# EAGLE design NES PSU Replacement (EAGLE 9.6.2)
PROJ_NAME: NES Power Supply Replacement; PROJ_REV: B

## Sheet 1 of 2: Switching Power Supply
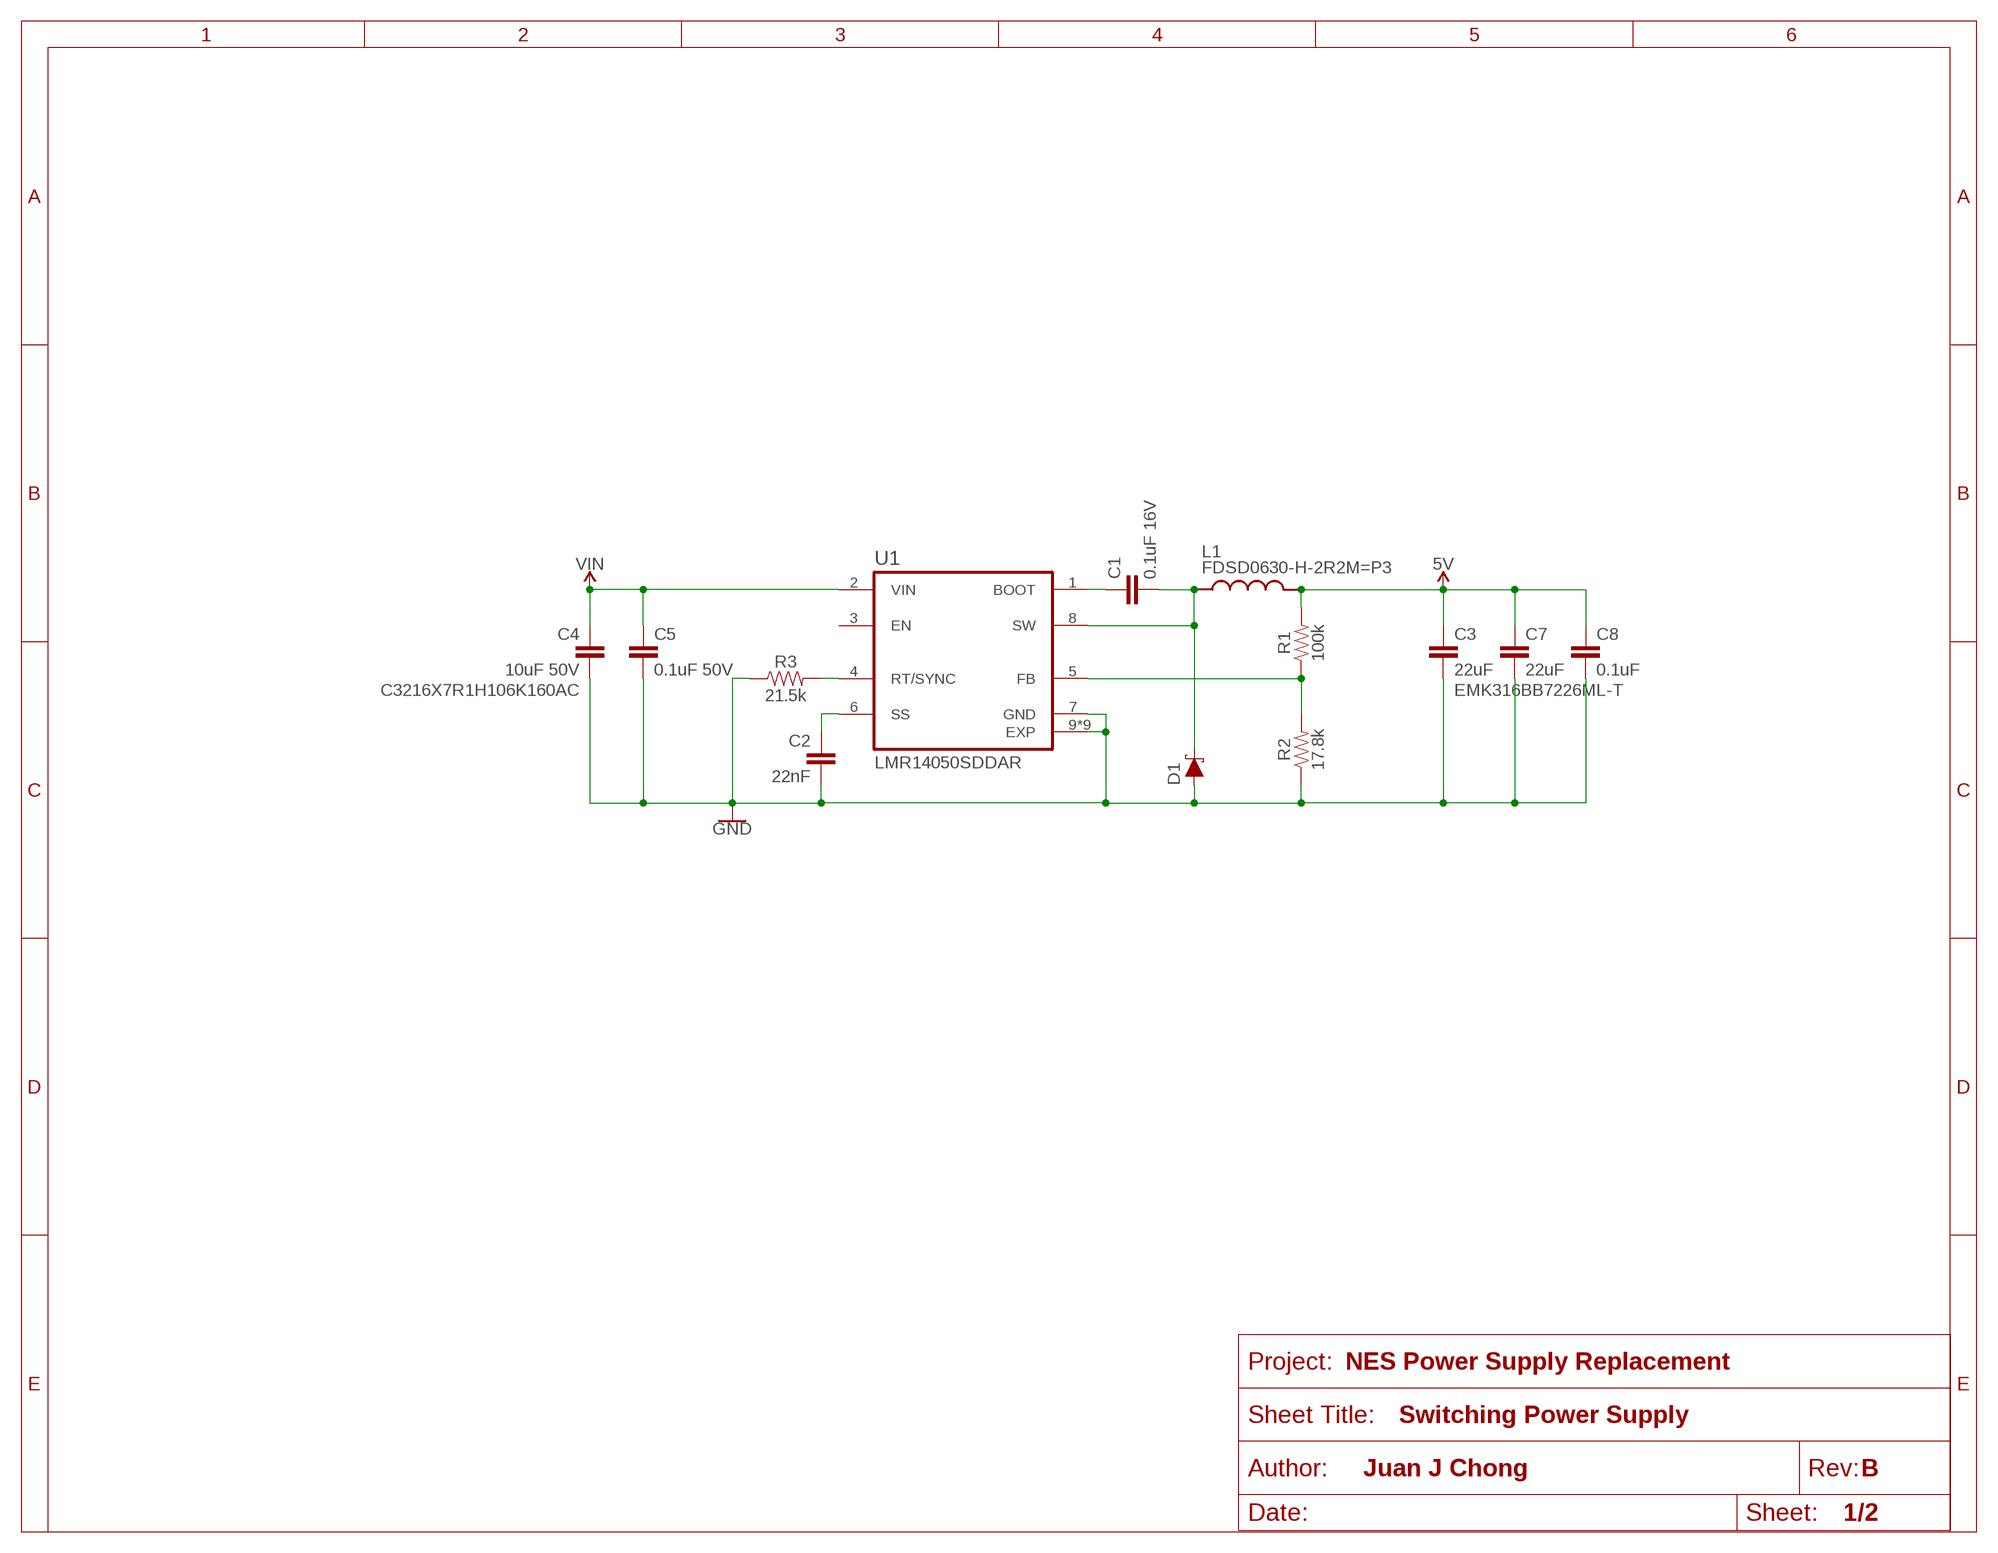
[diagram p0: schematic, sheet 1]

### Parts
C1  0.1uF 16V  CAP-0603  [0603]
C2  22nF  CAP-0603  [0603]
C3  22uF  CAP-1206  [1206]
C4  10uF 50V  CAP-1206  [1206]
C5  0.1uF 50V  CAP-0603  [0603]
C7  22uF  CAP-1206  [1206]
C8  0.1uF  CAP-0603  [0603]
D1  1A/15V/220mV  DIODE-SCHOTTKY-SK86C  [DO-214AB]
L1  FDSD0630-H-2R2M=P3  [IND_FDSD0630-H-2R2M=P3]
R1  100k  RESISTOR0603  [0603]
R2  17.8k  RESISTOR0603  [0603]
R3  21.5k  RESISTOR0603  [0603]
U1  LMR14050SDDAR  [VREG_LM5017MR/NOPB]

### Nets
5V: C3.1 C7.1 C8.1 L1.2 R1.2 ; also sheet 2
GND: C2.2 C3.2 C4.2 C5.2 C7.2 C8.2 D1.2(A) R2.1 R3.1 U1.7(GND) U1.9(EXP) U1.10(EXP) U1.11(EXP) U1.12(EXP) U1.13(EXP) U1.14(EXP) U1.15(EXP) U1.16(EXP) U1.17(EXP) ; also sheet 2
N$1: R1.1 R2.2 U1.5(FB)
N$2: R3.2 U1.4(RT/SYNC)
N$3: C2.1 U1.6(SS)
N$4: C1.2 D1.1(C) L1.1 U1.8(SW)
N$5: C1.1 U1.1(BOOT)
VIN: C4.1 C5.1 U1.2(VIN) ; also sheet 2
Unconnected: U1.3(EN)

### Notes on the sheet
- C3216X7R1H106K160AC | EMK316BB7226ML-T

## Sheet 2 of 2: Video Interface
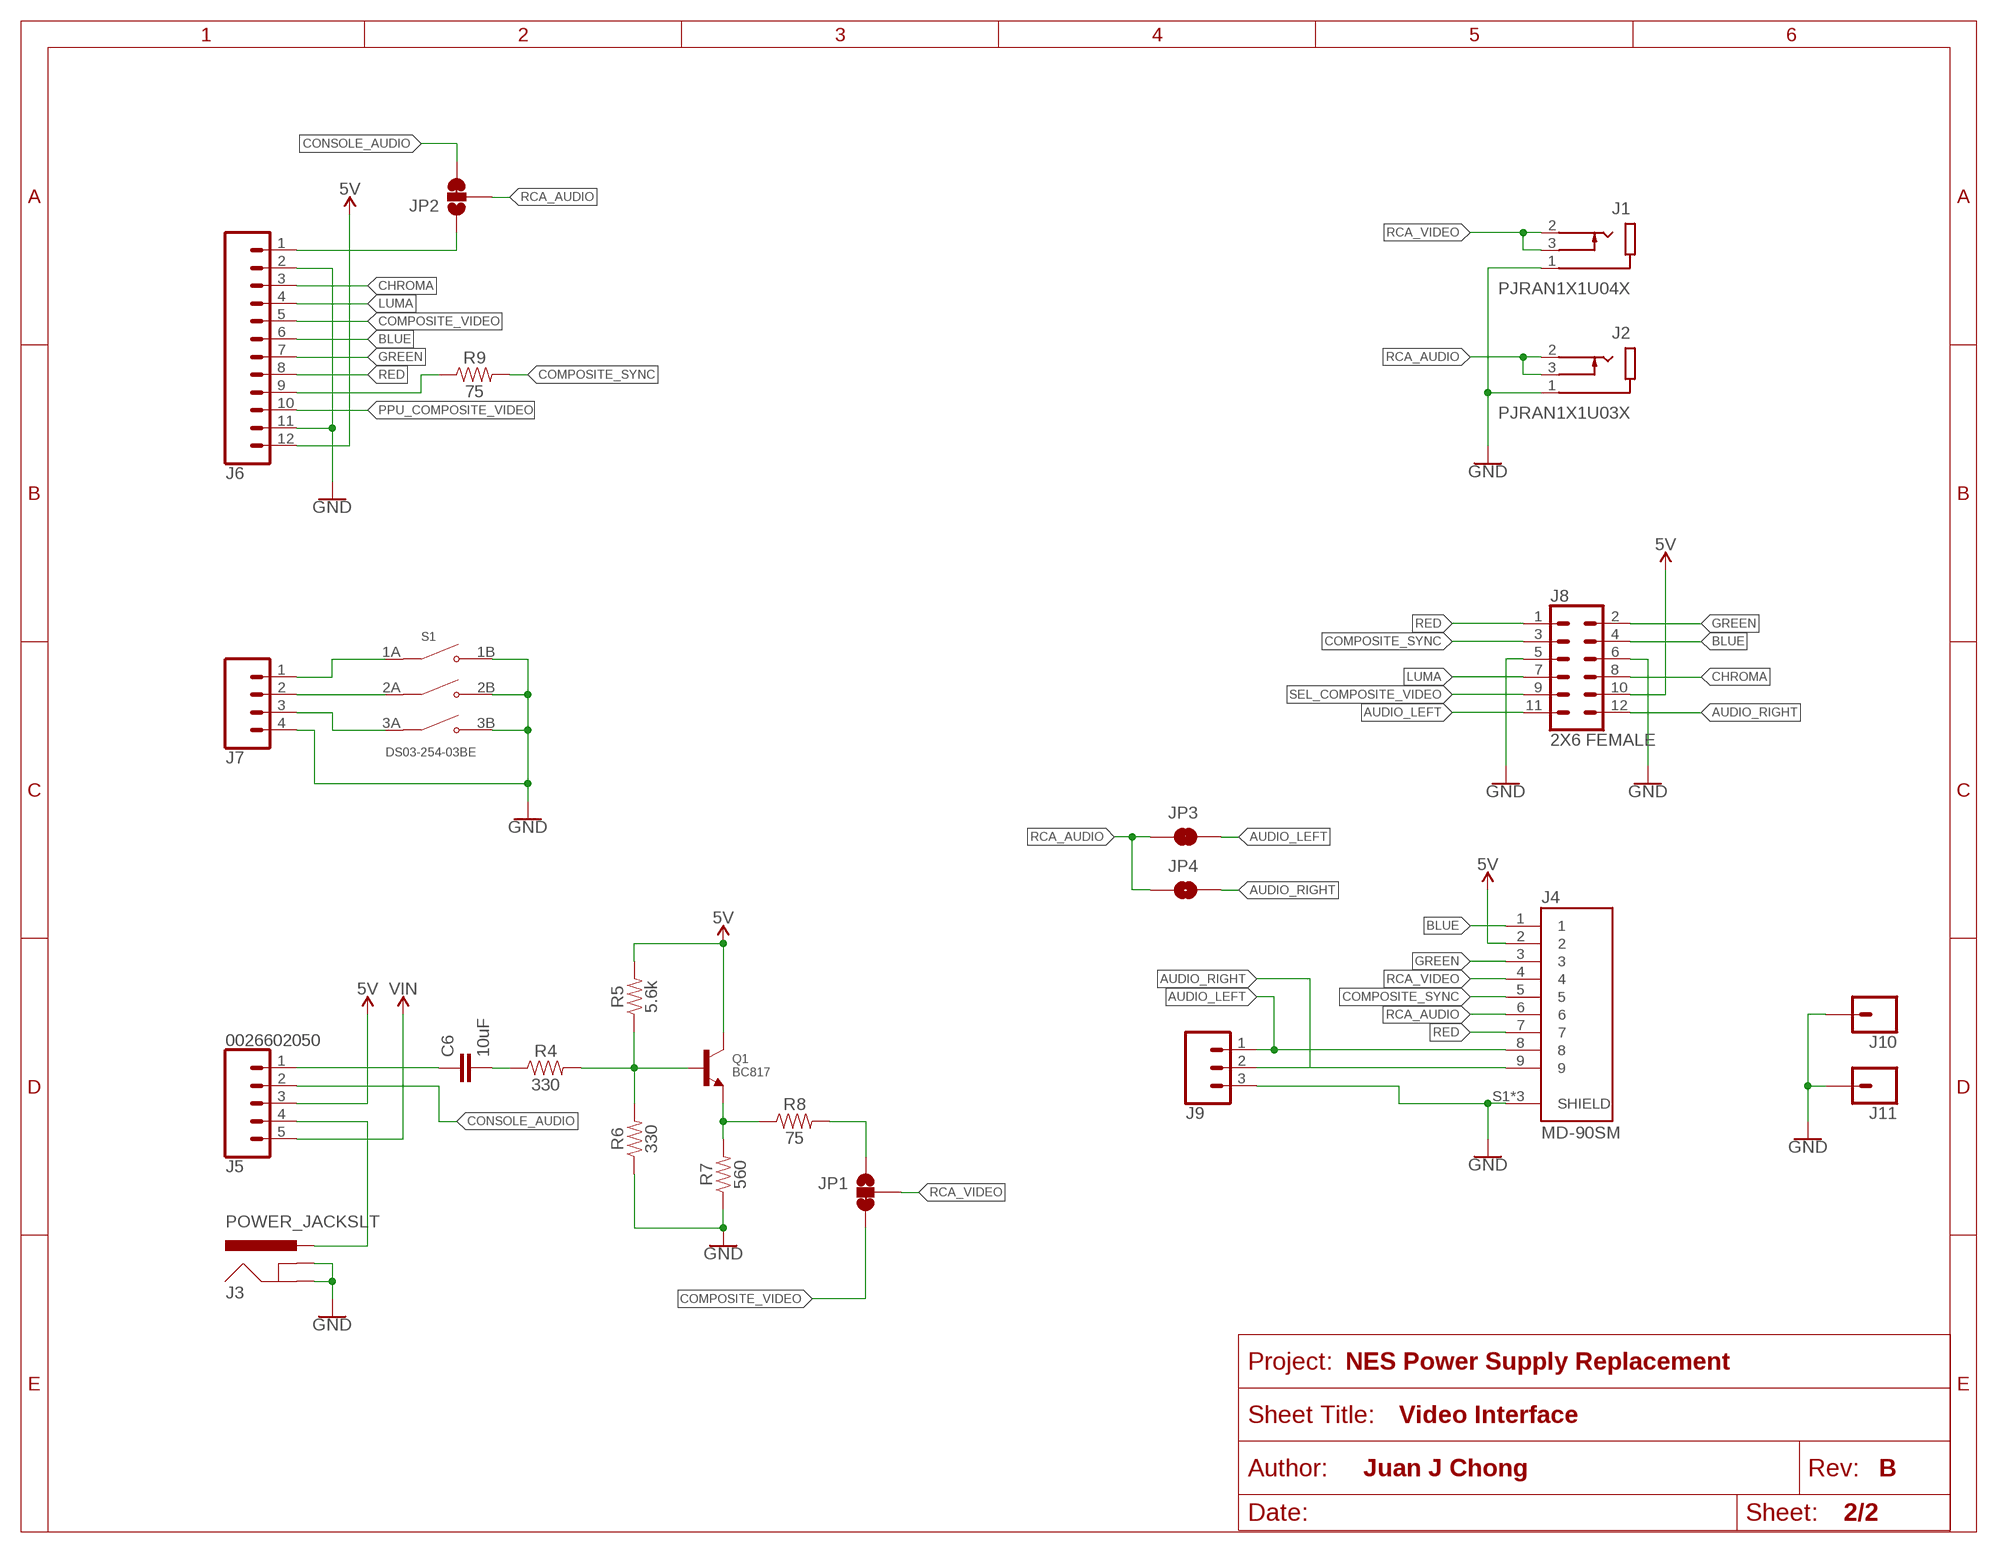
[diagram p1: schematic, sheet 2]

### Parts
C6  10uF  CAP-1206  [1206]
J1  PJRAN1X1U04X  PJRAN1X1U02AUX  [SWITCHCRAFT_PJRAN1X1U02AUX]
J2  PJRAN1X1U03X  PJRAN1X1U02AUX  [SWITCHCRAFT_PJRAN1X1U02AUX]
J3  POWER_JACKSLT  [POWER_JACK_SLOT]
J4  MD-90SM  [CUI_MD-90SM]
J5  0026602050  CONN_053.96MM  [1X05_3.96MM]
J6  CONN_12LONGPADS  [1X12_LONGPADS]
J7  CONN_04LONGPADS  [1X04_LONGPADS]
J8  2X6 FEMALE  CONN_06X2PTH_FEMALE  [2X6]
J9  CONN_03LONGPADS  [1X03_LONGPADS]
J10  CONN_01KEYSTONE_1216  [1X01_1216]
J11  CONN_01KEYSTONE_1216  [1X01_1216]
JP1  JUMPER-SMT_3_1-NC_TRACE_SILK  [SMT-JUMPER_3_1-NC_TRACE_SILK]
JP2  JUMPER-SMT_3_1-NC_TRACE_SILK  [SMT-JUMPER_3_1-NC_TRACE_SILK]
JP3  JUMPER-SMT_2_NC_TRACE_SILK  [SMT-JUMPER_2_NC_TRACE_SILK]
JP4  JUMPER-SMT_2_NO_SILK  [SMT-JUMPER_2_NO_SILK]
Q1  BC817  TRANSISTOR_NPN  [SOT23-R]
R4  330  RESISTOR0603  [0603]
R5  5.6k  RESISTOR0603  [0603]
R6  330  RESISTOR0603  [0603]
R7  560  RESISTOR0603  [0603]
R8  75  RESISTOR0603  [0603]
R9  75  RESISTOR0603  [0603]
S1  DS03-254-03BE  [SW_DS03-254-03BE]

### Nets
5V: J4.2 J5.3 J6.12 J8.10 Q1.3(C) R5.2 ; also sheet 1
AUDIO_LEFT: J4.8 J8.11 J9.1 JP3.2
AUDIO_RIGHT: J4.9 J8.12 J9.2 JP4.2
BLUE: J4.1 J6.6 J8.4
CHROMA: J6.3 J8.8
COMPOSITE_SYNC: J4.5 J8.3 R9.2
COMPOSITE_VIDEO: J6.5 JP1.3
CONSOLE_AUDIO: J5.2 JP2.3
GND: J1.1(SLEEVE) J2.1(SLEEVE) J3.GND@1(GNDBREAK) J3.GND@2(GND) J4.S1(SHIELD) J4.S2(SHIELD) J4.S3(SHIELD) J6.2 J6.11 J7.4 J8.5 J8.6 J9.3 J10.P$1 J10.P$2 J11.P$1 J11.P$2 R6.1 R7.1 S1.1B(NO1) S1.2B(NO2) S1.3B(NO3) ; also sheet 1
GREEN: J4.3 J6.7 J8.2
LUMA: J6.4 J8.7
N$6: J7.1 S1.1A(COM1)
N$7: J7.2 S1.2A(COM2)
N$8: J7.3 S1.3A(COM3)
N$9: Q1.1(B) R4.2 R5.1 R6.2
N$10: J3.PWR J5.4
N$11: JP1.1 R8.2
N$12: C6.2 R4.1
N$13: Q1.2(E) R7.2 R8.1
N$15: C6.1 J5.1
N$16: J6.9 R9.1
N$17: J6.1 JP2.1
PPU_COMPOSITE_VIDEO: J6.10
RCA_AUDIO: J2.2(TIP) J2.3(SHUNT) J4.6 JP2.2 JP3.1 JP4.1
RCA_VIDEO: J1.2(TIP) J1.3(SHUNT) J4.4 JP1.2
RED: J4.7 J6.8 J8.1
SEL_COMPOSITE_VIDEO: J8.9
VIN: J5.5 ; also sheet 1

## Library data of the parts
C1-C8 = SparkFun-Capacitors:CAP
D1 = SparkFun-DiscreteSemi:DIODE-SCHOTTKY: Schottky diode A Schottky diode is a semiconductor diode which has a low forward voltage drop and a very fast switching action.
J1 J2 = PJRAN1X1U02AUX:PJRAN1X1U02AUX: 3.20mm ID, 9.00mm OD (RCA) Phono (RCA) Jack Mono Connector Solder Check prices <https://pricing.snapeda.com/parts/PJRAN1X1U02AUX/Switchcraft/view-part?ref=eda>; AVAILABILITY: Good; DESCRIPTION: RCA Phono Connectors RCA PHONO JACK WHT.; MF: Switchcraft; MP: PJRAN1X1U02AUX; PACKAGE: None; PRICE: None; PURCHASE-URL: https://pricing.snapeda.com/search/part/PJRAN1X1U02AUX/?ref=eda
J3 = SparkFun-Connectors:POWER_JACK: Power Jack Connector This is the standard 5.5mm barrel jack for power. The PTH is the most common, proven, reliable, footprint. The Slot footprint only works if the mill layer is transmitted to the PCB fab house so be warned. Here are the connectors we sell at SparkFun: DC Barrel Power Jack/Connector <https://www.sparkfun.com/products/119> (PRT-00119) DC Barrel Power Jack/Connector (SMD) <https://www.sparkfun.com/products/12748> (PRT-12748) DC Barrel Jack Adapter - Breadboard Compatible <https://www.sparkfun.com/products/10811> (PRT-10811) It is used on this SparkFun product (and many, many others): SparkFun RedBoard - Programmed with Arduino <https://www.sparkfun.com/products/12757> (DEV-12757) Also, if you need a mating power supply or connector, please check these out: Wall Adapter Power Supply - 9VDC 650mA <https://www.sparkfun.com/products/298> (TOL-00298) DC Barrel Jack Adapter - Male <https://www.sparkfun.com/products/10287> (PRT-10287); PROD_ID: PRT-00119
J4 = MD-90SM:MD-90SM: 3~9 Positions, Receptacle, Right Angle, Through Hole, Shielded, Mini Circular DIN Connector Check prices <https://pricing.snapeda.com/parts/MD-90SM/CUI%20Devices/view-part?ref=eda>; AVAILABILITY: Good; CUI_PURCHASE_URL: https://www.cuidevices.com/product/interconnect/connectors/din-connectors/md-sm-series?utm_source=snapeda.com&utm_medium=referral&utm_campaign=snapedaBOM; DESCRIPTION: 3~9 Positions, Receptacle, Right Angle, Through Hole, Shielded, Mini Circular DIN Connector; MF: CUI Devices; MP: MD-90SM; PACKAGE: None; PRICE: None; PURCHASE-URL: https://pricing.snapeda.com/search/part/MD-90SM/?ref=eda
J5 = SparkFun-Connectors:CONN_05: Multi connection point. Often used as Generic Header-pin footprint for 0.1 inch spaced/style header connections On any of the 0.1 inch spaced packages, you can populate with these: Break Away Headers - Straight <https://www.sparkfun.com/products/116> (PRT-00116) Break Away Male Headers - Right Angle <https://www.sparkfun.com/products/553> (PRT-00553) Female Headers <https://www.sparkfun.com/products/115> (PRT-00115) Break Away Headers - Machine Pin <https://www.sparkfun.com/products/117> (PRT-00117) Break Away Female Headers - Swiss Machine Pin <https://www.sparkfun.com/products/743> (PRT-00743) For SCREWTERMINALS and SPRING TERMINALS visit here: Screw Terimnals on SparkFun.com <https://www.sparkfun.com/search/results?term=Screw+Terminals> (5mm/3.5mm/2.54mm spacing) This device is also useful as a general connection point to wire up your design to another part of your project. Our various solder wires solder well into these plated through hole pads. Hook-Up Wire - Assortment (Stranded, 22 AWG) <https://www.sparkfun.com/products/11375> (PRT-11375) Hook-Up Wire - Assortment (Solid Core, 22 AWG) <https://www.sparkfun.com/products/11367> (PRT-11367) View the entire wire category on our website here <https://www.sparkfun.com/categories/141> Special notes: Molex polarized connector foot print use with SKU : PRT-08231 with associated crimp pins and housings. 1MM SMD Version SKU: PRT-10208
J6 = SparkFun-Connectors:CONN_12: Multi connection point. Often used as Generic Header-pin footprint for 0.1 inch spaced/style header connections On any of the 0.1 inch spaced packages, you can populate with these: Break Away Headers - Straight <https://www.sparkfun.com/products/116> (PRT-00116) Break Away Male Headers - Right Angle <https://www.sparkfun.com/products/553> (PRT-00553) Female Headers <https://www.sparkfun.com/products/115> (PRT-00115) Break Away Headers - Machine Pin <https://www.sparkfun.com/products/117> (PRT-00117) Break Away Female Headers - Swiss Machine Pin <https://www.sparkfun.com/products/743> (PRT-00743) For SCREWTERMINALS and SPRING TERMINALS visit here: Screw Terimnals on SparkFun.com <https://www.sparkfun.com/search/results?term=Screw+Terminals> (5mm/3.5mm/2.54mm spacing) This device is also useful as a general connection point to wire up your design to another part of your project. Our various solder wires solder well into these plated through hole pads. Hook-Up Wire - Assortment (Stranded, 22 AWG) <https://www.sparkfun.com/products/11375> (PRT-11375) Hook-Up Wire - Assortment (Solid Core, 22 AWG) <https://www.sparkfun.com/products/11367> (PRT-11367) View the entire wire category on our website here <https://www.sparkfun.com/categories/141> Special notes: Molex polarized connector foot print use with SKU : PRT-08231 with associated crimp pins and housings. 1MM SMD Version SKU: PRT-10208 NOTES ON THE VARIANTS LOCK and LOCK_LONGPADS... This footprint was designed to help hold the alignment of a through-hole component (i.e. 6-pin header) while soldering it into place. You may notice that each hole has been shifted either up or down by 0.005 of an inch from it's more standard position (which is a perfectly straight line). This slight alteration caused the pins (the squares in the middle) to touch the edges of the holes. Because they are alternating, it causes a "brace" to hold the component in place. 0.005 has proven to be the perfect amount of "off-center" position when using our standard breakaway headers. Although looks a little odd when you look at the bare footprint, once you have a header in there, the alteration is very hard to notice. Also,if you push a header all the way into place, it is covered up entirely on the bottom side.
J7 = SparkFun-Connectors:CONN_04: Multi connection point. Often used as Generic Header-pin footprint for 0.1 inch spaced/style header connections On any of the 0.1 inch spaced packages, you can populate with these: Break Away Headers - Straight <https://www.sparkfun.com/products/116> (PRT-00116) Break Away Male Headers - Right Angle <https://www.sparkfun.com/products/553> (PRT-00553) Female Headers <https://www.sparkfun.com/products/115> (PRT-00115) Break Away Headers - Machine Pin <https://www.sparkfun.com/products/117> (PRT-00117) Break Away Female Headers - Swiss Machine Pin <https://www.sparkfun.com/products/743> (PRT-00743) For SCREWTERMINALS and SPRING TERMINALS visit here: Screw Terimnals on SparkFun.com <https://www.sparkfun.com/search/results?term=Screw+Terminals> (5mm/3.5mm/2.54mm spacing) This device is also useful as a general connection point to wire up your design to another part of your project. Our various solder wires solder well into these plated through hole pads. Hook-Up Wire - Assortment (Stranded, 22 AWG) <https://www.sparkfun.com/products/11375> (PRT-11375) Hook-Up Wire - Assortment (Solid Core, 22 AWG) <https://www.sparkfun.com/products/11367> (PRT-11367) View the entire wire category on our website here <https://www.sparkfun.com/categories/141> Special notes: Molex polarized connector foot print use with SKU : PRT-08231 with associated crimp pins and housings. 1MM SMD Version SKU: PRT-10208; PROD_ID: CONN-09696
J8 = SparkFun-Connectors:CONN_06X2: Multi connection point. Often used as Generic Header-pin footprint for 0.1 inch spaced/style header connections On any of the 0.1 inch spaced packages, you can populate with these: Break Away Headers - Straight <https://www.sparkfun.com/products/116> (PRT-00116) Break Away Male Headers - Right Angle <https://www.sparkfun.com/products/553> (PRT-00553) Female Headers <https://www.sparkfun.com/products/115> (PRT-00115) Break Away Headers - Machine Pin <https://www.sparkfun.com/products/117> (PRT-00117) Break Away Female Headers - Swiss Machine Pin <https://www.sparkfun.com/products/743> (PRT-00743); PROD_ID: CONN-12423
J9 = SparkFun-Connectors:CONN_03: Multi connection point. Often used as Generic Header-pin footprint for 0.1 inch spaced/style header connections On any of the 0.1 inch spaced packages, you can populate with these: Break Away Headers - Straight <https://www.sparkfun.com/products/116> (PRT-00116) Break Away Male Headers - Right Angle <https://www.sparkfun.com/products/553> (PRT-00553) Female Headers <https://www.sparkfun.com/products/115> (PRT-00115) Break Away Headers - Machine Pin <https://www.sparkfun.com/products/117> (PRT-00117) Break Away Female Headers - Swiss Machine Pin <https://www.sparkfun.com/products/743> (PRT-00743) Stackable Header - 3 Pin (Female, 0.1") <https://www.sparkfun.com/products/13875> (PRT-13875) For SCREWTERMINALS and SPRING TERMINALS visit here: Screw Terimnals on SparkFun.com <https://www.sparkfun.com/search/results?term=Screw+Terminals> (5mm/3.5mm/2.54mm spacing) This device is also useful as a general connection point to wire up your design to another part of your project. Our various solder wires solder well into these plated through hole pads. Hook-Up Wire - Assortment (Stranded, 22 AWG) <https://www.sparkfun.com/products/11375> (PRT-11375) Hook-Up Wire - Assortment (Solid Core, 22 AWG) <https://www.sparkfun.com/products/11367> (PRT-11367) View the entire wire category on our website here <https://www.sparkfun.com/categories/141> Special notes: Molex polarized connector foot print use with SKU : PRT-08232 with associated crimp pins and housings.
J10 J11 = SparkFun-Connectors:CONN_01: Single connection point. Often used as Generic Header-pin footprint for 0.1 inch spaced/style header connections On any of the 0.1 inch spaced packages, you can populate with these: Break Away Headers - Straight <https://www.sparkfun.com/products/116> (PRT-00116) Break Away Male Headers - Right Angle <https://www.sparkfun.com/products/553> (PRT-00553) Female Headers <https://www.sparkfun.com/products/115> (PRT-00115) Break Away Headers - Machine Pin <https://www.sparkfun.com/products/117> (PRT-00117) Break Away Female Headers - Swiss Machine Pin <https://www.sparkfun.com/products/743> (PRT-00743) This device is also useful as a general connection point to wire up your design to another part of your project. Our various solder wires solder well into these plated through hole pads. Hook-Up Wire - Assortment (Stranded, 22 AWG) <https://www.sparkfun.com/products/11375> (PRT-11375) Hook-Up Wire - Assortment (Solid Core, 22 AWG) <https://www.sparkfun.com/products/11367> (PRT-11367) View the entire wire category on our website here <https://www.sparkfun.com/categories/141> Special notes: SMTSO-256-ET is a "flush mount" nut for a 4-40 screw. We mostly use this on specialty testbeds; it is a nice way to connect hardware to your PCB at an adjustable hieght. Also note, the SNAP packages are for using a snappable style connector. We sell a baggie of snaps and they are also used on two LilyPad designs: Snap Assortment - 30 pack (male and female) <https://www.sparkfun.com/products/11347> (DEV-11347) LilyPad Arduino SimpleSnap <https://www.sparkfun.com/products/10941> (DEV-10941) LilyPad SimpleSnap Protoboard <https://www.sparkfun.com/products/10940> (DEV-10940)
JP1 JP2 = SparkFun-Jumpers:JUMPER-SMT_3_1-NC_TRACE: Normally closed trace jumper (1 of 2 connections) This jumper has a trace between two pads so it's normally closed (NC). The other connection is normally open (NO). Use a razor knife to open the connection. For best results follow the IPC guidelines for cutting traces: Cutout at least 0.063 mm (0.005 in). Remove all loose material to clean up the cut area. Seal the cut with an approved epoxy. Reapply solder to reclose the connection, or to close the NO connection.
JP3 = SparkFun-Jumpers:JUMPER-SMT_2_NC_TRACE: Normally closed trace jumper This jumper has a trace between two pads so it's normally closed (NC). Use a razor knife to open the connection. For best results follow the IPC guidelines for cutting traces: Cutout at least 0.063 mm (0.005 in). Remove all loose material to clean up the cut area. Seal the cut with an approved epoxy. Reapply solder to reclose the connection.
JP4 = SparkFun-Jumpers:JUMPER-SMT_2_NO: Normally open jumper This jumper has two pads in close proximity to each other. Apply solder to close the connection. Round pads are easier to solder for beginners, but are a lot larger. SparkFun Product that uses the round pads: SparkFun EL Sequencer <https://www.sparkfun.com/products/12781>
L1 = FDSD0630-H-2R2M_P3:FDSD0630-H-2R2M=P3: 2.2µH Shielded Wirewound Inductor 7.1A 17mOhm Max Nonstandard Check prices <https://pricing.snapeda.com/parts/FDSD0630-H-2R2M%3DP3/Murata/view-part?ref=eda>; AVAILABILITY: Warning; DESCRIPTION: Inductor with Inductance: 2.2uH Tol. +/-20%, Package: 2726 (7066); MF: Murata; MP: FDSD0630-H-2R2M=P3; PACKAGE: NONSTANDARD; PRICE: None; PURCHASE-URL: https://pricing.snapeda.com/search/part/FDSD0630-H-2R2M=P3/?ref=eda
Q1 = microbuilder:TRANSISTOR_NPN: NPN Transistor Transistor (NPN) 500mA 45V - BC817 [Digikey: 568-1631-1-ND] Transistor (NPN) 500mA 45V - BC817,215 [Mouser: 771-BC817-T/R] SOT23-R - SOT23 footprint optimised for use with solder paste and reflow ovens. SOT23-W - SOT23 footprint optimised for hand-soldering (larger pads).
R1-R9 = SparkFun-Resistors:RESISTOR: Generic Resistor Package
S1 = DS03-254-03BE:DS03-254-03BE: Check prices <https://pricing.snapeda.com/parts/DS03-254-03BE/CUI%20Devices/view-part?ref=eda>; AVAILABILITY: Warning; CUI_PURCHASE_URL: https://www.cuidevices.com/product/switches/dip-switches/ds03-254-series?utm_source=snapeda.com&utm_medium=referral&utm_campaign=snapedaBOM; DESCRIPTION: 3 Position, Through Hole, 2.54 mm, Flat Slide Actuator, Convex Bottom, Long Pin, DIP Switch; MF: CUI Devices; MP: DS03-254-03BE; PACKAGE: None; PRICE: None; PURCHASE-URL: https://pricing.snapeda.com/search/part/DS03-254-03BE/?ref=eda
U1 = LMR14050SDDAR:LMR14050SDDAR: Check prices <https://pricing.snapeda.com/parts/LMR14050SDDAR/Texas%20Instruments/view-part?ref=eda> Check prices <https://pricing.snapeda.com/parts/LMR14050SDDAR/Texas%20Instruments/view-part?ref=eda> Check prices <https://pricing.snapeda.com/parts/LMR14050SDDAR/Texas%20Instruments/view-part?ref=eda>; AVAILABILITY: Warning; DESCRIPTION: SIMPLE SWITCHER 40-V, 5-A, 2.2-MHz step-down converter with 40-?A IQ 8-SO PowerPAD -40 to 125; MF: Texas Instruments; MP: LMR14050SDDAR; PACKAGE: HSOIC-8 Texas Instruments; PRICE: None; PURCHASE-URL: https://pricing.snapeda.com/search/part/LMR14050SDDAR/?ref=eda

## Board
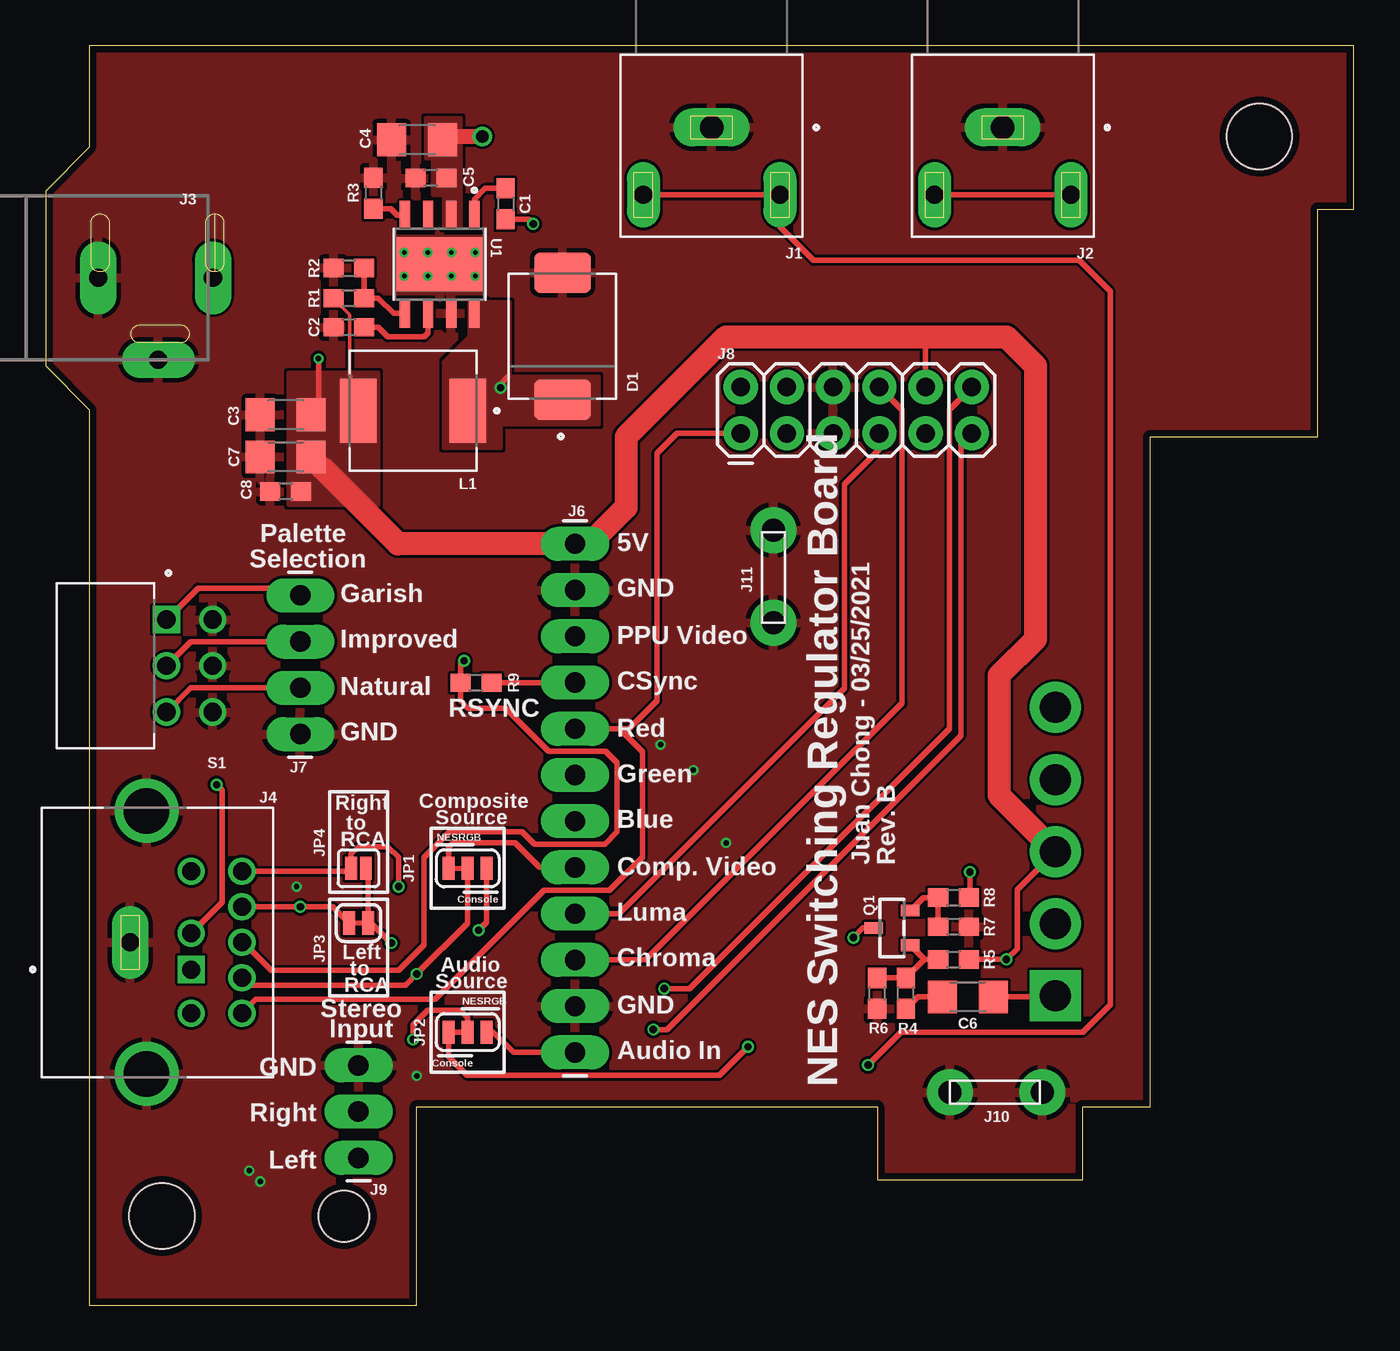
[diagram p2: board, top side]
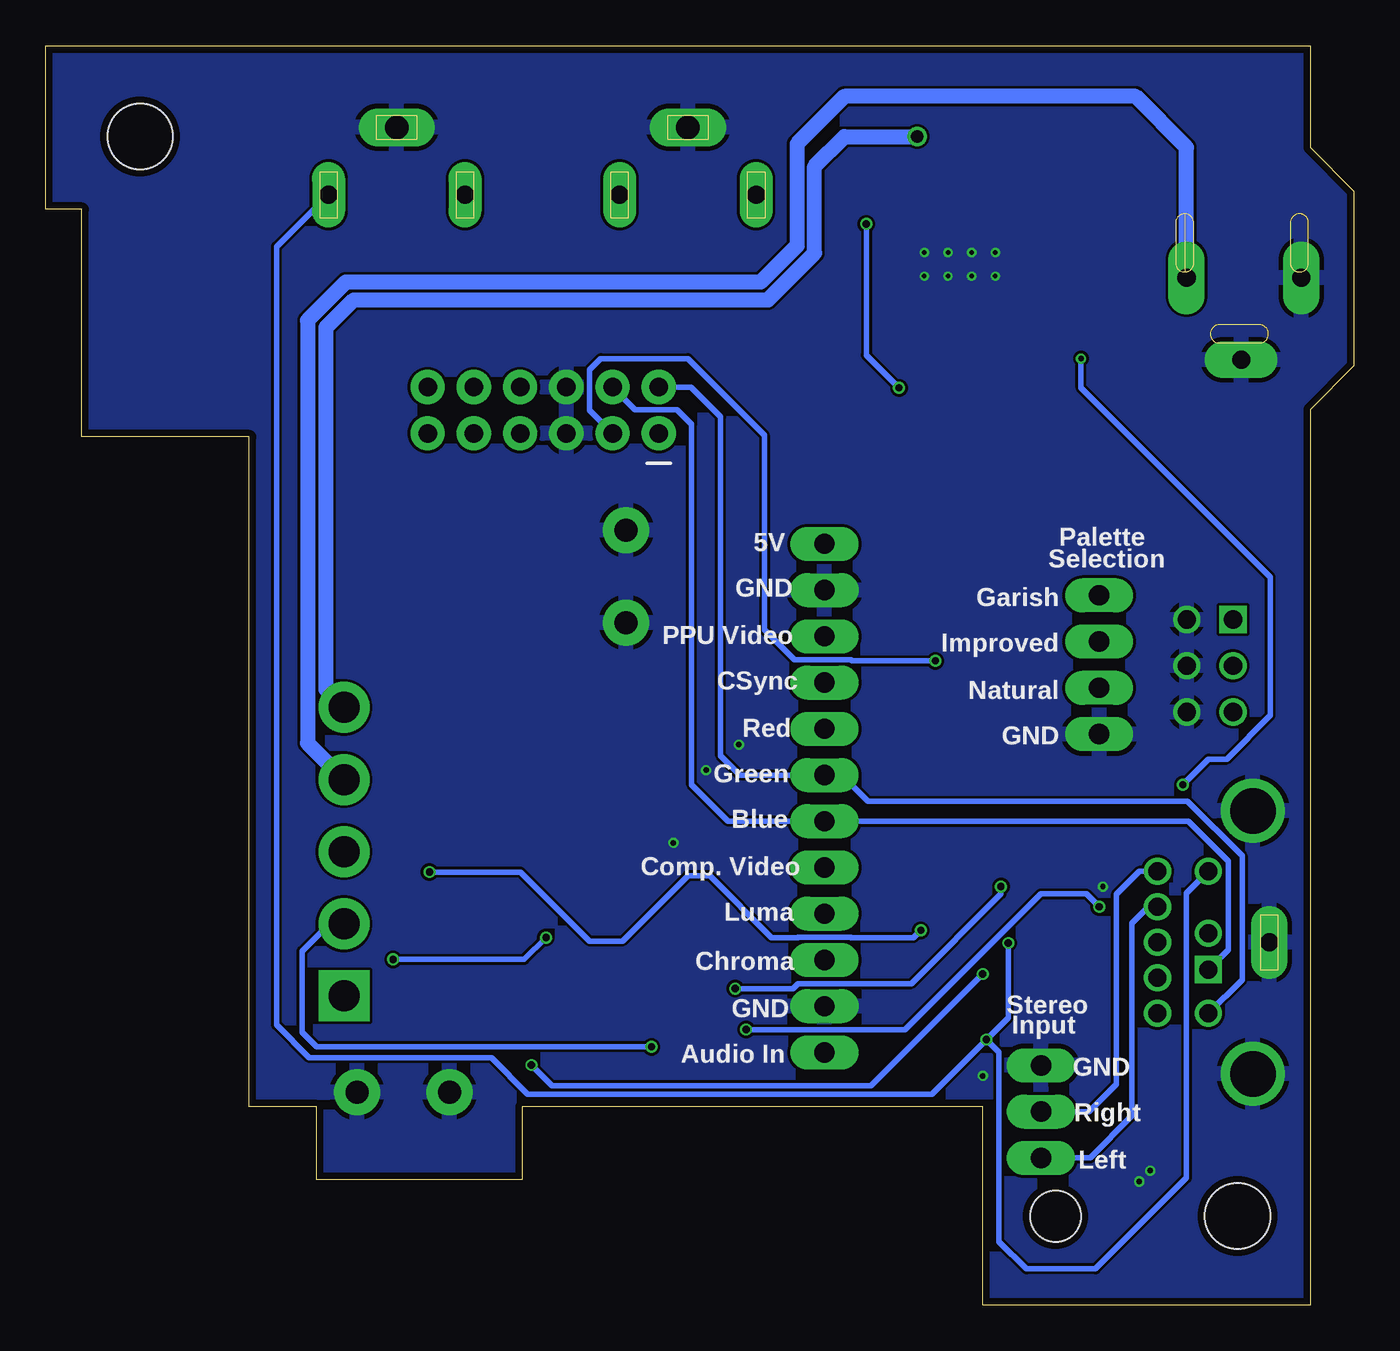
[diagram p3: board, bottom side, seen from below]

Size 71.9 x 69.2 mm. Coordinates in mm from the lower left corner, seen from the top.
Outline: 20.4,10.9 45.7,10.9 45.7,6.9 57,6.9 57,10.9 60.7,10.9 60.7,47.7 69.9,47.7 69.9,60.2 71.9,60.2 71.9,69.2 2.4,69.2 2.4,63.6 0,61.2 0,51.6 2.4,49.2 2.4,0 20.4,0 20.4,10.9
Copper layers (1*16): Top 0.035559375mm / dielectric 1.6mm / Bottom 0.035559375mm
Design rules "oshpark-2layer-covered-vias": minimum track width 6mil, minimum drill 10mil, track to track 6mil, track to pad 6mil, pad to pad 6mil, via to via 6mil, smd to smd 6mil, copper to edge 15mil, drill to drill 6mil, minimum pad ring 5mil, minimum via ring 5mil, stop-mask expansion 2.5mil, vias tented up to drill 0mil, thermal gap 10mil
Holes 3.6 mm at 66.7,64.2 6.4,4.9
Holes 2.8 mm at 16.4,4.9

### Footprints (pad centres in the part's own frame; a part is rotated, then mirrored left to right if it is on the bottom)
0603 = smd 1.1 x 1: 1 -0.85,0; 2 0.85,0
1206 = smd 1.6 x 1.8: 1 -1.4,0; 2 1.4,0
DO-214AB = smd 2.18 x 3.12: 1 -3.485,0; 2 3.485,0
SWITCHCRAFT_PJRAN1X1U02AUX = drill 1.3 pad 2.1 long: 1 0,0 | drill 1 pad 1.8 long: 2 -3.75,3.7; 3 3.75,3.7
POWER_JACK_SLOT = drill 1 pad 2 long: GND@1 4.5,7.4; GND@2 9,10.7; PWR 4.5,13.7
CUI_MD-90SM = drill 1 square: 1 1.5,1.85 | drill 1: 2 -0.5,1.85; 3 3.9,1.85; 4 1.95,4.65; 5 0,4.65; 6 -3.9,1.85; 7 3.9,4.65; 8 -1.95,4.65; 9 -3.9,4.65 | drill 2.5: S1 7.225,-0.6; S2 -7.225,-0.6 | drill 1 pad 2 long: S3 0,-1.5
1X05_3.96MM = drill 1.7 pad 2.8 square: 1 0,0 | drill 1.7 pad 2.8: 2 3.96,0; 3 7.92,0; 4 11.88,0; 5 15.84,0
1X12_LONGPADS = drill 1.118 pad 1.88 long: 1 0,0; 2 2.54,0; 3 5.08,0; 4 7.62,0; 5 10.16,0; 6 12.7,0; 7 15.24,0; 8 17.78,0; 9 20.32,0; 10 22.86,0; 11 25.4,0; 12 27.94,0
1X04_LONGPADS = drill 1.118 pad 1.88 long: 1 0,0; 2 2.54,0; 3 5.08,0; 4 7.62,0
2X6 = drill 1.016 pad 1.88: 1 0,0; 2 0,2.54; 3 2.54,0; 4 2.54,2.54; 5 5.08,0; 6 5.08,2.54; 7 7.62,0; 8 7.62,2.54; 9 10.16,0; 10 10.16,2.54; 11 12.7,0; 12 12.7,2.54
1X03_LONGPADS = drill 1.118 pad 1.88 long: 1 0,0; 2 2.54,0; 3 5.08,0
1X01_1216 = drill 1.27 pad 2.54: P$1 0,0; P$2 5.08,0
SMT-JUMPER_3_1-NC_TRACE_SILK = smd 0.66 x 1.27: 1 -1.041,0; 2 0,0; 3 1.041,0
SMT-JUMPER_2_NC_TRACE_SILK = smd 0.66 x 1.27: 1 -0.521,0; 2 0.521,0
SMT-JUMPER_2_NO_SILK = smd 0.635 x 1.27: 1 -0.406,0; 2 0.406,0
IND_FDSD0630-H-2R2M=P3 = smd 2 x 3.5: 1 -3,0; 2 3,0
SOT23-R = smd 0.635 x 1.016: 1 -0.95,-1; 2 0.95,-1; 3 0,1
SW_DS03-254-03BE = drill 1 square: 1A -2.54,-1.27 | drill 1: 1B -2.54,1.27; 2A 0,-1.27; 2B 0,1.27; 3A 2.54,-1.27; 3B 2.54,1.27
VREG_LM5017MR/NOPB = smd 1.55 x 0.6: 1 -2.7,1.905; 2 -2.7,0.635; 3 -2.7,-0.635; 4 -2.7,-1.905; 5 2.7,-1.905; 6 2.7,-0.635; 7 2.7,0.635; 8 2.7,1.905 | smd 2.95 x 4.9: 9 0,0 | drill 0.254 pad 0.406: 10 -0.65,1.95; 11 0.65,1.95; 12 -0.65,0.65; 13 0.65,0.65; 14 -0.65,-0.65; 15 0.65,-0.65; 16 -0.65,-1.95; 17 0.65,-1.95

### Placement (x,y rotation side)
C1  25.28,60.5 270 top
C2  16.67,53.72 180 top
C3  13.2,48.92 180 top
C4  20.42,64.02 180 top
C5  21.18,61.92 180 top
C6  50.68,16.94 180 top
C7  13.2,46.6 180 top
C8  13.2,44.7 180 top
D1  28.41,53.23 90 top
J1  36.6,64.7 180 top
J2  52.6,64.7 180 top
J3  -4.5,60.94 270 top
J4  6.15,19.94 270 top
J5  55.5,17 90 top
J6  29.1,13.89 90 top
J7  14,39 270 top
J8  38.2,47.9 0 top
J9  17.2,8.1 90 top
J10  49.7,11.7 0 top
J11  40,37.5 90 top
JP1  23.2,24 180 top
JP2  23.2,15 180 top
JP3  17.2,21 180 top
JP4  17.2,24 180 top
L1  20.2,49.14 180 top
Q1  46.52,20.73 90 top
R1  16.67,55.32 180 top
R2  16.67,56.98 0 top
R3  18.02,61.09 270 top
R4  47.28,17.13 90 top
R5  49.9,19 0 top
R6  45.7,17.13 90 top
R7  49.9,20.8 180 top
R8  49.9,22.4 0 top
R9  23.65,34.2 180 top
S1  7.92,35.13 270 top
U1  21.66,57.18 270 top

### Tracks (layer width: path | path; a pad name or v marks a point on that pad's centre or on a via)
5V  (via drill 0.3, 0.4)
  Top 0.2: R1.2 16.72,54.42 16.72,51.08 16.8,51
  Top 0.3: R5.2 v52.8,19 53.4,19.6 53.4,22.82 J5.3 | v44.4,20.2 44.93,20.73 Q1.3 | J4.2 9.7,22.14 9.7,28.3 v9.4,28.6 | J8.10 48.36,53.16 48.4,53.2 | v15,52 15,49
  Top 1.27: J5.3 52.4,28.02 52.4,34.6 54.4,36.6 54.4,51.6 52.8,53.2 48.4,53.2 37.4,53.2 31.9,47.7 31.9,43.83 29.9,41.83 J6.12 19.37,41.83 15.2,46
  Bottom 0.3: v52.8,19 45.6,19 v44.4,20.2 | v9.4,28.6 8,30 7,30 4.6,32.4 4.6,40 15,50.4 v15,52
  pour Top (no thermals): 13.4,51.2 13.4,44 18.24,44 18.24,51.2
AUDIO_LEFT  (via drill 0.4)
  Top 0.3: J4.8 v14,21.89 15.79,21.89 JP3.2 | J8.11 50.3,47.3 50.3,31.3 34.15,15.15 v33.4,15.15
  Bottom 0.3: J4.8 11.31,21.89 12.2,21 12.2,10.4 14.5,8.1 J9.1 | v33.4,15.15 24.67,15.15 17.22,22.6 14.71,22.6 v14,21.89
AUDIO_RIGHT  (via drill 0.4)
  Top 0.3: J4.9 16.63,23.84 JP4.2 16.79,24.79 17.2,25.2 18.8,25.2 19.4,24.6 v19.4,23 | J8.12 49.66,49.2 49.66,31.66 35.4,17.4 v34,17.4
  Bottom 0.3: J4.9 11.8,23.84 13.05,22.59 13.05,12.15 14.56,10.64 J9.2 | v34,17.4 30.83,17.4 30.55,17.67 24.33,17.67 19.4,22.6 v19.4,23
BLUE
  Bottom 0.3: J4.1 6.9,19.54 6.9,24.4 9.09,26.59 J6.6 34.39,26.59 36.4,28.6 36.4,48.4 37.2,49.2 38.71,49.2 38.72,49.2 39.5,49.2 J8.4
CHROMA
  Top 0.3: J6.3 32.97,18.97 47.06,33.06 47.06,49.2 J8.8
COMPOSITE_SYNC  (via drill 0.4)
  Top 0.3: J4.5 10.86,19.94 12.4,18.4 19.4,18.4 20.8,19.8 20.8,24.6 22.2,26 26.2,26 26.87,25.33 30.73,25.33 31.4,26 31.4,29.8 30.77,30.43 27.65,30.43 25.27,32.8 23.2,32.8 22.8,33.2 R9.2 22.8,35.2 v23,35.4
  Bottom 0.3: J8.3 42,49.16 42,51.4 41.4,52 36.6,52 32.4,47.8 32.4,37.1 30.75,35.45 27.65,35.45 27.59,35.4 v23,35.4
COMPOSITE_VIDEO
  Top 0.3: JP1.3 22.16,25.16 22.4,25.4 25.8,25.4 27.15,24.05 J6.5
CONSOLE_AUDIO  (via drill 0.4)
  Top 0.3: JP2.3 22.16,13.64 23.15,12.65 37.05,12.65 v38.6,14.2
  Bottom 0.3: J5.2 56.3,20.96 57.8,19.46 57.8,15 57,14.2 v38.6,14.2
GND  (via drill 0.3)
  other vias: 37.4,25.4 13.8,23 33.8,30.8 35.6,29.4 11.2,7.4 11.8,6.8 20.4,12.6
  pour Top (rank 2): -3.6,74.2 -3.6,-3.8 76.4,-3.8 76.4,74.2
  pour Bottom: -2.6,75.2 -2.6,-2.8 77.4,-2.8 77.4,75.2
  pour Top (no thermals): 18.4,58.7 24.4,58.7 24.4,55.6 18.8,55.6 18.4,56
  pour Top (no thermals): 26.2,55.4 26,55.4 25.8,55.6
GREEN
  Bottom 0.3: J4.3 6.15,17.89 6.15,24.69 9.16,27.7 26.7,27.7 28.13,29.13 J6.7 33.73,29.13 34.8,30.2 34.8,48.8 36.44,50.44 J8.2
LUMA
  Top 0.3: J6.4 31.51,21.51 43.9,33.9 43.9,45.1 45.82,47.02 J8.7
N$1
  Top 0.3: R2.2 R1.1 18.28,55.32 19.12,54.48 U1.5
N$2
  Top 0.3: U1.4 19.32,59.88 18.96,60.24 R3.2
N$3
  Top 0.3: C2.1 18.28,53.72 18.8,53.2 20.8,53.2 21.02,53.43 U1.6
N$4  (via drill 0.4)
  Top 0.3: C1.2 26.55,59.65 v26.8,59.4 | 25.4,51 25,50.6 v25,50.4
  Bottom 0.3: v26.8,59.4 26.8,52.2 v25,50.4
  pour Top (no thermals): 25.5,55.1 23.3,55.1 23.3,53.2 21.9,51.8 21.9,47.1 25,47.1 25,48.4 30.4,48.4 30.4,51 25.5,51
N$5
  Top 0.3: U1.1 23.56,60.77 24.15,61.35 C1.1
N$6
  Top 0.3: S1.1A 8.38,39.4 13.6,39.4 J7.1
N$7
  Top 0.3: J7.2 7.98,36.46 S1.2A
N$8
  Top 0.3: J7.3 7.98,33.92 S1.3A
N$9
  Top 0.3: Q1.1 48.3,19 | 48.3,19 R4.2 R6.2 | 48.3,19 R5.1
N$10
  Bottom 0.813: J5.4 57.5,30.88 57.5,54.1 55.4,56.2 32.6,56.2 30.6,58.2 30.6,63.8 28,66.4 12,66.4 9.2,63.6 J3.PWR
N$11  (via drill 0.4)
  Top 0.3: v50.8,23.8 50.8,22.45 R8.2 | JP1.1 24.24,21.04 v23.8,20.6
  Bottom 0.3: v23.8,20.6 24.2,20.2 27.63,20.2 27.65,20.21 30.55,20.21 30.57,20.2 32,20.2 35.4,23.6 36.6,23.6 40.2,20 42,20 45.8,23.8 v50.8,23.8
N$12
  Top 0.3: R4.1 47.94,16.94 C6.2
N$13
  Top 0.3: Q1.2 48.24,22.4 R8.1 R7.2
N$15
  Top 0.3: J5.1 55.44,16.94 C6.1
N$16
  Top 0.3: J6.9 R9.1
N$17
  Top 0.3: JP2.1 24.6,15 25.71,13.89 J6.1
RCA_AUDIO  (via drill 0.4)
  Top 0.3: v20.2,14.6 20.2,15.4 21,16.2 22.8,16.2 23.2,15.8 JP2.2 | v19,19.9 17.9,21 JP3.1 17.72,23.89 JP4.1 | J2.3 J2.2
  Bottom 0.3: J4.6 9.2,22.64 9.2,7 14.2,2 18,2 19.5,3.5 19.5,13.9 v20.2,14.6 | v20.2,14.6 19,15.8 v19,19.9 | v20.2,14.6 23.2,11.6 45.4,11.6 47.4,13.6 57.4,13.6 59.2,15.4 59.2,58.15 J2.2
RCA_VIDEO  (via drill 0.4)
  Top 0.3: J4.4 11.2,17.59 19.79,17.59 v20.4,18.2 23.2,21 JP1.2 | v45.2,13.2 47,15 57,15 58.5,16.5 58.5,55.7 56.8,57.4 42.2,57.4 40.35,59.25 J1.2 J1.3
  Bottom 0.3: v20.4,18.2 26.55,12.05 44.05,12.05 v45.2,13.2
RED
  Top 0.3: J4.7 11.56,16.8 21.4,16.8 27.4,22.8 31,22.8 32.8,24.6 32.8,30.4 31.53,31.67 J6.8 32.07,31.67 33.6,33.2 33.6,46.8 34.7,47.9 J8.1
VIN  (via drill 0.7)
  Top 0.813: v24,64.2 22,64.2 C4.1
  Bottom 0.813: J5.5 56.5,33.84 56.5,53.7 54.96,55.23 32.2,55.23 29.63,57.8 29.63,62.57 28,64.2 v24,64.2
  pour Top (no thermals): 20.9,65.2 20.9,63 21.3,63 21.3,61 21.9,61 21.9,59.2 22.8,59.2 22.8,65.2

### Text on the board
tNames: Palette | 5V | Selection | GND | Garish | Improved | PPU Video | CSync | Natural | RSYNC | GND | Red | Green | Right | Composite | to | Source | Blue | RCA | NESRGB | Juan Chong - 03/25/2021 | Rev. B | Comp. Video | Console | Luma | Left | to | Audio | Chroma | RCA | Source | Stereo | NESRGB | GND | Input | GND | Console | Audio In | NES Switching Regulator Board | Right | Left
bNames: Palette | 5V | Selection | Garish | GND | Improved | PPU Video | Natural | CSync | GND | Red | Green | Blue | Comp. Video | Luma | Chroma | Stereo | GND | Input | GND | Audio In | Right | Left